# EAGLE design dimmer230_single_channel (EAGLE 4.16)
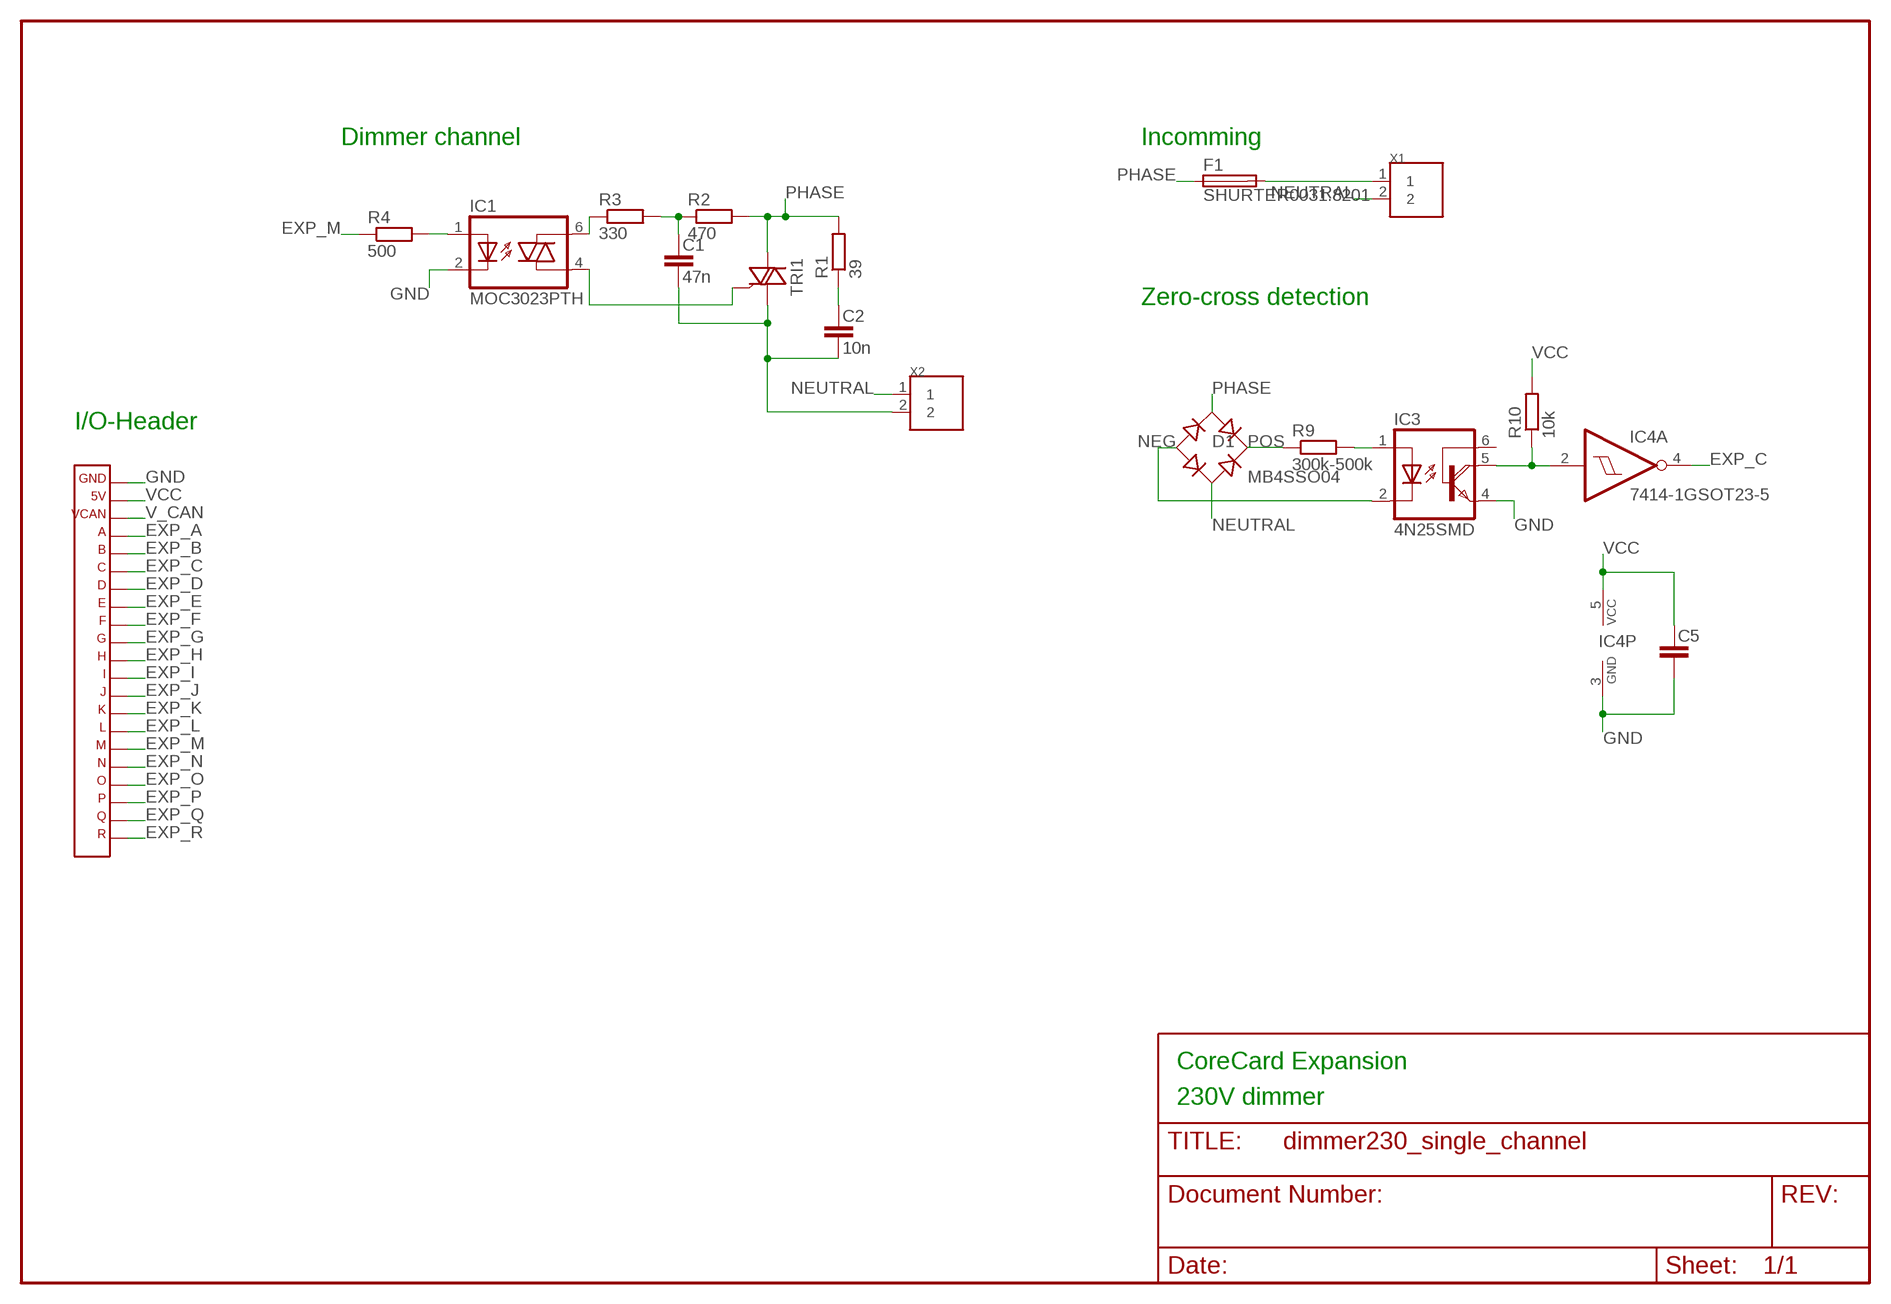
[diagram p0: schematic, sheet 1]

## Parts
C1  47n  C-EUC1812  [C1812]
C2  10n  C-EUC1210  [C1210]
C5  C-EUC0603  [C0603]
D1  MB4SSO04  [SOIC-4]
F1  SHURTER0031.8201  [22.5]
IC1  MOC3023PTH  [DIL06]
IC3  4N25SMD  [SMD-DIL06]
IC4  7414-1GSOT23-5  [SOT23-5]
R1  39  R-EUR1206  [R1206]
R2  470  R-EUR1206  [R1206]
R3  330  R-EUR1206  [R1206]
R4  500  R-EUR0603  [R0603]
R9  300k-500k  R-EUR1206  [R1206]
R10  10k  R-EUR0603  [R0603]
TRI1  BTA204SDPAK  [DPAK]
X1  BLOCK25.08  [PCB2_5.08]
X2  BLOCK25.08  [PCB2_5.08]
X3  CORE_IOHEADEXP  [CORE_IOHEAD_NOSILC]

## Nets
EXP_A: X3.4
EXP_B: X3.5
EXP_C: IC4.4(A:O) X3.6
EXP_D: X3.7
EXP_E: X3.8
EXP_F: X3.9
EXP_G: X3.10
EXP_H: X3.11
EXP_I: X3.12
EXP_J: X3.13
EXP_K: X3.14
EXP_L: X3.15
EXP_M: R4.1 X3.16
EXP_N: X3.17
EXP_O: X3.18
EXP_P: X3.19
EXP_Q: X3.20
EXP_R: X3.21
GATE1: IC1.4(A1) TRI1.3(G)
GND: C5.2 IC1.2(C) IC3.4(E) IC4.3(P:GND) X3.1
LOAD1: C1.2 C2.2 TRI1.1(T1) X2.2
N$1: IC1.6(A2) R3.1
N$2: C1.1 R2.1 R3.2
N$3: IC3.1(A) R9.2
N$4: IC1.1(A) R4.2
N$5: IC3.5(COL) IC4.2(A:I) R10.1
N$7: C2.1 R1.1
NEG: D1.4(-) IC3.2(C)
NEUTRAL: D1.2(AC2) X1.2 X2.1
PHASE: D1.1(AC1) F1.P$1 R1.2 R2.2 TRI1.MB(T2)
POS: D1.3(+) R9.1
UNFUSED_PHASE: F1.P$2 X1.1
V_CAN: X3.3
VCC: C5.1 IC4.5(P:VCC) R10.2 X3.2
Unconnected: IC3.6(B)

## Notes on the sheet
- Dimmer channel | Incomming
- Zero-cross detection
- I/O-Header
- CoreCard Expansion
- 230V dimmer

## Library data of the parts
C1 C2 C5 = rcl:C-EU
D1 = rectifier_mb4s:MB4S
F1 = fuseholder_schurter:SHURTER0031.8201
IC1 = moc3023:MOC3023
IC3 = optocoupler_4n25:4N25
IC4 = 7414:7414-1G
R1-R4 R9 R10 = rcl:R-EU
TRI1 = triac:BTA204S
X1 X2 = terminal_block:BLOCK2
X3 = expboard:CORE_IOHEAD: CoreCard IO-header for expansion cards

## Board
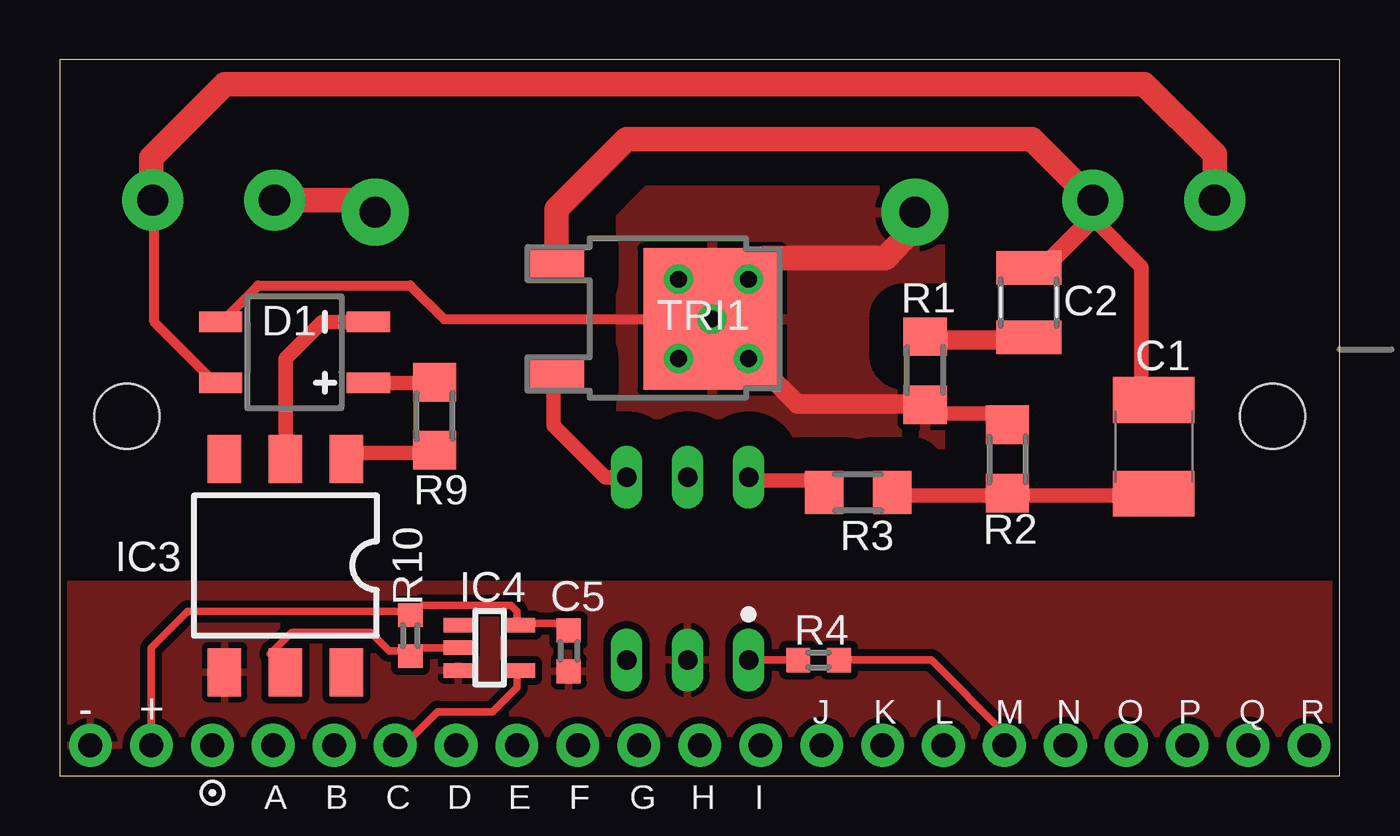
[diagram p1: board, top side]
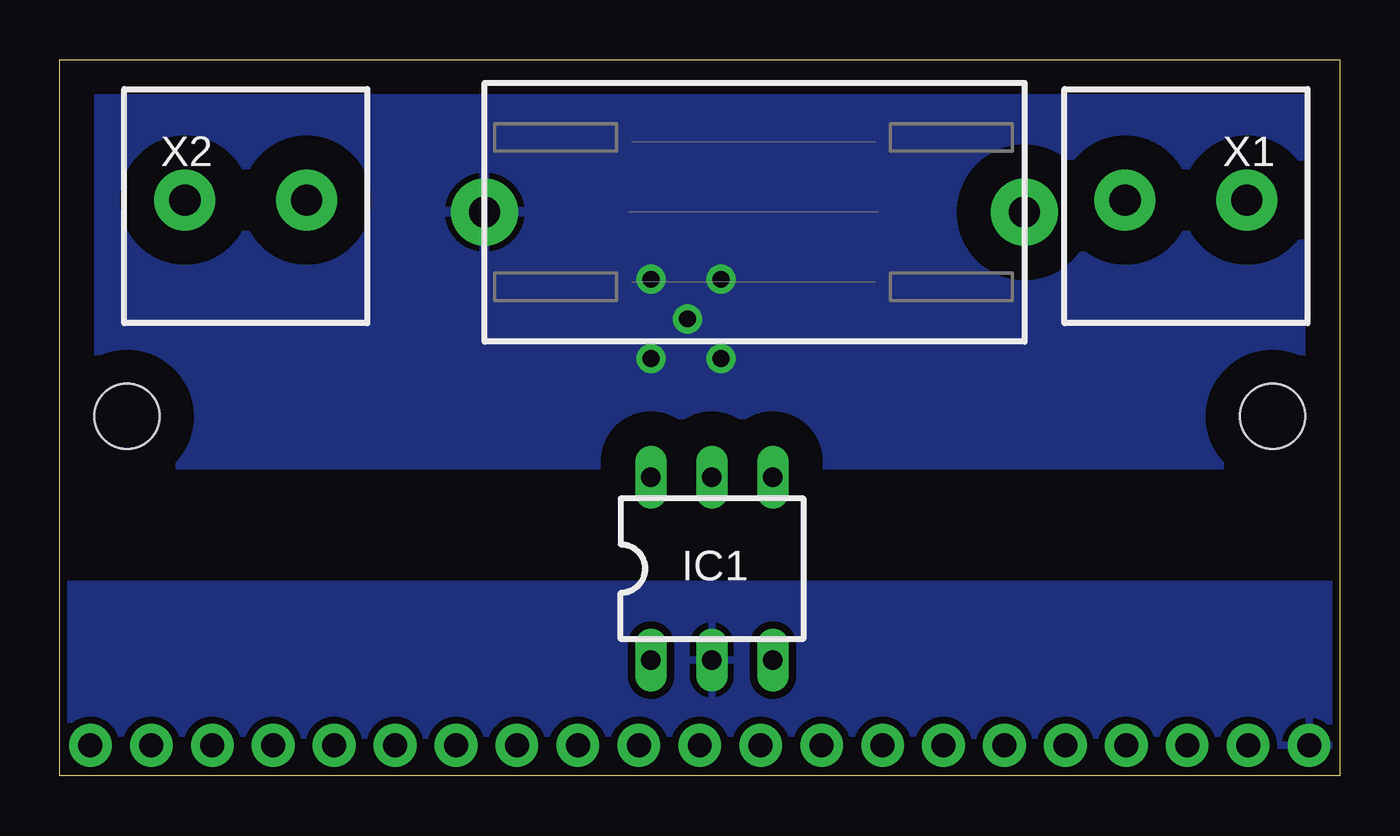
[diagram p2: board, bottom side, seen from below]

Size 53.34 x 29.84 mm. Coordinates in mm from the lower left corner, seen from the top.
Outline: 0,0 53.34,0 53.34,29.84 0,29.84 0,0
Copper layers (1*16): Top 0.035mm / dielectric 1.5mm / Bottom 0.035mm
Design rules "default": minimum track width 10mil, minimum drill 0.6mm, track to track 10mil, track to pad 10mil, pad to pad 10mil, via to via 10mil, smd to smd 8mil, copper to edge 10mil, drill to drill 8mil, minimum pad ring 10mil, minimum via ring 10mil, stop-mask expansion 4mil, vias tented up to drill 0mil, thermal gap 10mil
Holes 2.7 mm at 50.55,14.99 2.79,14.99

### Footprints (pad centres in the part's own frame; a part is rotated, then mirrored left to right if it is on the bottom)
C1812 = smd 1.9 x 3.4: 1 -1.95,0; 2 1.95,0
C1210 = smd 1.4 x 2.7: 1 -1.4,0; 2 1.5,0
C0603 = smd 1 x 1: 1 -0.85,0; 2 0.85,0
SOIC-4 = smd 0.86 x 1.8: 1 -1.905,-3.075; 2 0.635,-3.075; 3 0.635,3.075; 4 -1.905,3.075
22.5 = drill 1.3 pad 2.794 round: P$1 11.25,0; P$2 -11.25,0
DIL06 = drill 0.813 long: 1 -2.54,-3.81; 2 0,-3.81; 3 2.54,-3.81; 4 2.54,3.81; 5 0,3.81; 6 -2.54,3.81
SMD-DIL06 = smd 1.4 x 2: 1 -2.54,-4.445; 2 0,-4.445; 3 2.54,-4.445; 4 2.54,4.445; 5 0,4.445; 6 -2.54,4.445
SOT23-5 = smd 0.6 x 1.2: 1 -0.95,-1.306; 2 0,-1.306; 3 0.95,-1.306; 4 0.95,1.306; 5 -0.95,1.306
R1206@1 = smd 1.6 x 1.803: 1 -1.422,0; 2 1.422,0
R0603@1 = smd 0.991 x 1.016: 1 -0.85,0; 2 0.85,0
R1206 = smd 1.6 x 1.803: 1 -1.422,0; 2 1.422,0
R0603 = smd 0.991 x 1.016: 1 -0.85,0; 2 0.85,0
DPAK = smd 1.5 x 2.4: 1 -2.3,-1.2; 3 2.3,-1.2 | smd 5.9 x 5.75: MB 0,5.35
PCB2_5.08 = drill 1.3 pad 2.54 round: 1 -2.54,0; 2 2.54,0
CORE_IOHEAD_NOSILC = drill 1 pad 1.778 round: 1 25.4,0; 2 22.86,0; 3 20.32,0; 4 17.78,0; 5 15.24,0; 6 12.7,0; 7 10.16,0; 8 7.62,0; 9 5.08,0; 10 2.54,0; 11 0,0; 12 -2.54,0; 13 -5.08,0; 14 -7.62,0; 15 -10.16,0; 16 -12.7,0; 17 -15.24,0; 18 -17.78,0; 19 -20.32,0; 20 -22.86,0; 21 -25.4,0

### Placement (x,y rotation side)
C1  45.59,13.72 90 top
C2  40.39,19.68 90 top
C5  21.21,5.21 270 top
D1  9.78,17.02 270 top
F1  24.38,23.5 180 bottom
IC1  26.16,8.64 0 bottom
IC3  9.4,8.76 180 top
IC4  17.91,5.33 270 top
R1  39  [R1206@1]  36.07,16.89 270 top
R2  470  [R1206@1]  39.5,13.21 90 top
R3  330  [R1206@1]  33.27,11.81 0 top
R4  500  [R0603@1]  31.62,4.83 180 top
R9  15.62,14.99 270 top
R10  14.61,5.84 90 top
TRI1  21.84,19.05 270 top
X1  6.4,24 0 bottom
X2  45.59,24 0 bottom
X3  26.67,1.27 0 bottom

### Tracks (layer width: path | path; a pad name or v marks a point on that pad's centre or on a via)
EXP_C
  Top 0.305: IC4.4 19.09,4.35 19.05,4.45 19.05,3.68 18.03,2.67 15.75,2.67 14.35,1.27 X3.6
EXP_M
  Top 0.305: X3.16 39.37,1.78 36.32,4.83 R4.1
GATE1
  Top 0.61: IC1.4 22.73,12.45 20.57,14.61 20.57,16.76 20.63,16.76 TRI1.3
GND
  pour Bottom (isolate 0.305, rank 3): 0,7.98 53.34,7.98 53.34,1.14 0,1.14
  pour Top (isolate 0.305, rank 3): 0,7.98 53.34,7.98 53.34,1.14 0,1.14
LOAD1
  Top 0.61: C1.2 45.26,16 45.09,16 45.09,21.21 43.05,23.24 X2.2
  Top 0.813: TRI1.1 20.64,21.53 | C2.2 41.12,21.31 43.05,23.24
  Top 1.016: X2.2 40.51,26.54 23.62,26.54 20.7,23.62 20.7,21.59
  Top 1.27: 20.64,21.53 20.7,21.59
N$1
  Top 0.61: R3.1 31.85,11.84 31.37,12.32 28.83,12.32 IC1.6
N$2
  Top 0.61: C1.1 45.51,11.68 39.5,11.68 R2.1 39.47,11.79 39.37,11.68 34.54,11.68 34.67,11.81 R3.2
N$3
  Top 0.61: IC3.1 11.68,13.46 15.37,13.46 R9.2
N$4
  Top 0.305: IC1.1 R4.2
N$5
  Top 0.305: 16.64,5.33 IC4.2 14.61,5.33 14.26,4.99 R10.1 14.52,5.21 13.72,5.21 12.95,5.97 9.65,5.97 8.76,5.08 IC3.5
N$6  (via drill 0.8 pad 2.7)
  other vias: 2.79,14.99
N$7
  Top 0.61: C2.1 39.63,18.16 39.5,18.16 | 35.94,18.16 35.81,18.29 R1.1
  Top 0.813: 35.94,18.16 39.5,18.16
N$8  (via drill 0.8 pad 2.7)
  other vias: 50.55,14.99
NEG
  Top 0.61: IC3.2 9.4,17.4 10.92,18.92 D1.4
NEUTRAL
  Top 0.406: D1.2 6.48,16.38 3.94,18.92 3.94,23.37 X1.2
  Top 0.813: 3.81,23.75 3.86,23.7 X1.2
  Top 1.016: X2.1 48.13,25.91 45.21,28.83 6.86,28.83 3.81,25.78 3.81,23.75
PHASE  (via drill 0.7)
  Top 0.406: 27.19,19.03 16.02,19.03 14.61,20.45 8.26,20.45 6.73,18.92 D1.1
  Top 0.61: R2.2 39.34,14.63 38.86,15.11 36.2,15.11 35.94,15.24 R1.2 35.69,15.49 | 27.19,19.03 TRI1.MB
  Top 0.813: 35.69,15.49 30.73,15.49 27.19,19.03
  Top 1.016: F1.P$1 35.56,22.79 34.42,21.59 29.34,21.59 27.19,19.45
  Top 1.27: TRI1.MB 27.19,19.45
  other vias: 25.78,20.7 28.7,20.7 25.78,17.4 28.7,17.4 27.18,19.05
  pour Bottom (isolate 1.422, rank 3): 0,29.84 0,12.95 53.34,12.95 53.34,29.84
  pour Top (isolate 1.422, rank 3): 23.37,29.84 23.37,12.95 36.7,12.95 36.7,29.84
POS
  Top 0.61: R9.1 15.39,16.41 15.11,16.38 D1.3 12.7,16.38
UNFUSED_PHASE
  Top 0.813: 13.08,23.62 F1.P$2
  Top 1.016: 13.08,23.62 12.83,24 X1.1
VCC
  Top 0.305: C5.1 21.12,6.18 21.08,6.35 19.18,6.35 19.12,6.28 | 19.12,6.28 19.05,6.35 19.05,6.86 18.8,7.11 15.11,7.11 14.57,6.82 R10.2 14.35,6.73 14.35,6.86 5.33,6.86 3.81,5.33 X3.2 | 19.12,6.28 IC4.5

### Text on the board
tPlace: - | + | J | K | L | M | N | O | P | Q | R | A | B | C | D | E | F | G | H | I
Document: Top is component side | Expansion will be mounted bottom to bottom with CoreCard
tDocu: Edge of | CoreCard